# Altium schematic sheet Power Supply.SchDoc
size A
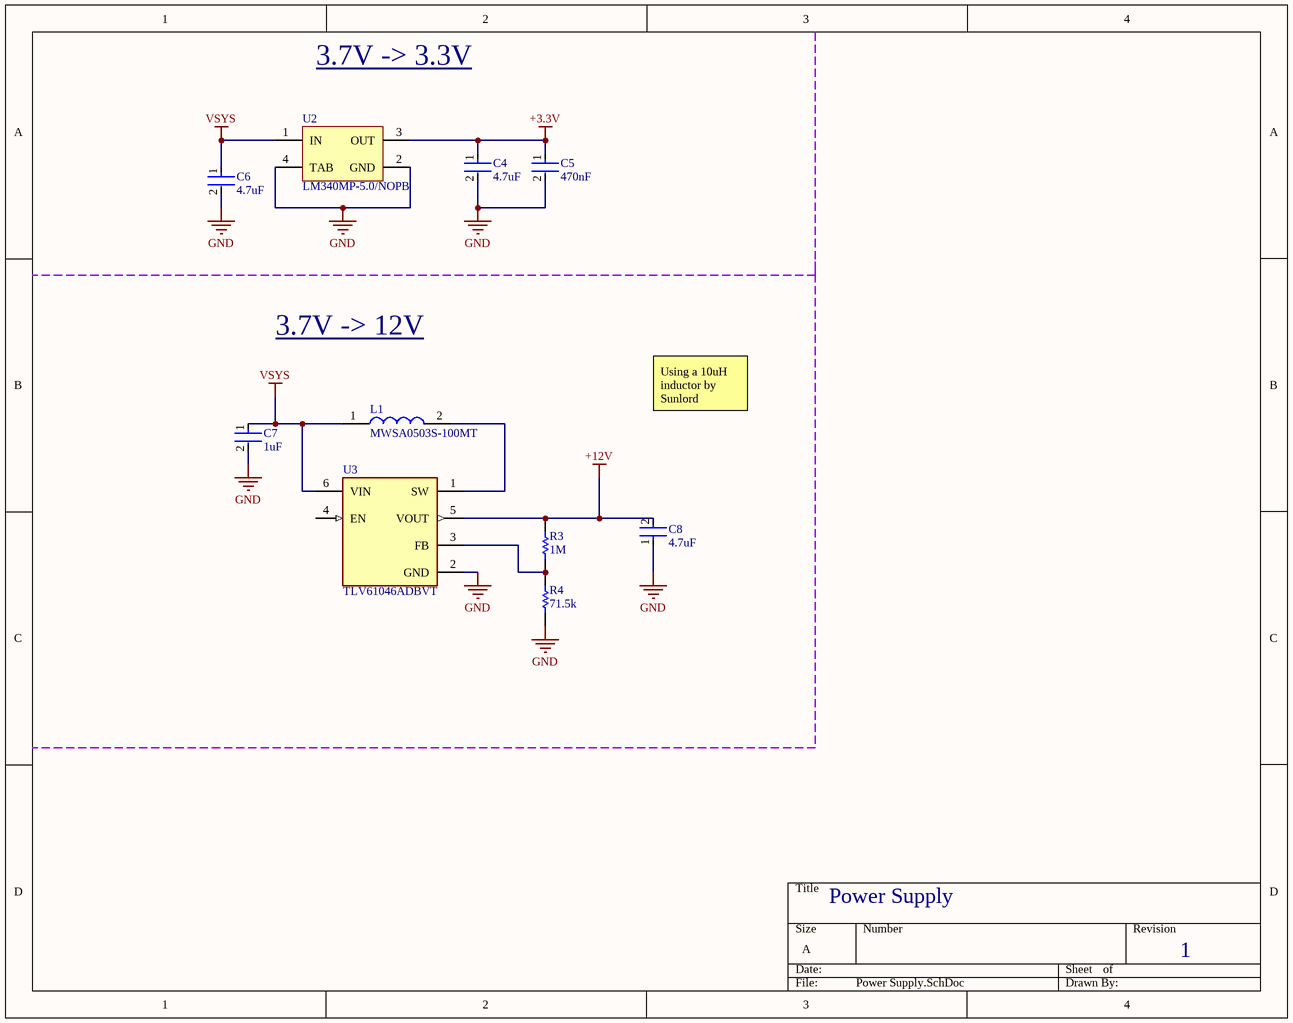
[diagram p0: Power Supply.SchDoc]

## Parts
C4  4.7uF  [FP-CC0805-0_85-MFG]
C5  470nF  [FP-CC0805-0_85-MFG]
C6  4.7uF  [FP-CC0805-0_85-MFG]
C7  1uF  [FP-CC0805-0_85-MFG]
C8  4.7uF  [FP-CC0805-0_85-MFG]
L1  MWSA0503S-100MT  [MWSA0503S4R7MT]
R3  value 1M  [RESC2013X70X40ML20T20]  (hidden comment: Resistor 1k +/-1% 0805 125 mW)
R4  value 71.5k  [RESC2013X70X40ML20T20]  (hidden comment: Resistor 1k +/-1% 0805 125 mW)
U2  LM340MP-5.0/NOPB  [DCY0004A_L]
U3  TLV61046ADBVT  [FP-DBV0006A-MFG]

## Nets
+3.3V: C4.1 C5.1 U2.3(OUT)
+12V: C8.2 R3.2 U3.5(VOUT)
GND: C4.2 C5.2 C6.2 C7.2 C8.1 R4.1 U2.2(GND) U2.4(TAB) U3.2(GND)
VSYS: C6.1 C7.1 L1.1 U2.1(IN) U3.6(VIN)
NetL1_2: L1.2 U3.1(SW)
NetR3_1: R3.1 R4.2 U3.3(FB)

Not connected (* = marked no-connect by the designer): U3 4(EN)

## Notes on the sheet
- 3.7V -> 3.3V
- 3.7V -> 12V
- Using a 10uH inductor by Sunlord
  MFR.Part #MWSA0503S-100MT
  LCSC Part # C408412
  PackageSMD-5.2x5.4x2.8
  CAD model and footpring, using this one: MWSA0503S-4R7MT
- Power Supply
- 1

## Library data of the parts
C4-C8 = CMP-03422-000499-1: CAP CER 0.1UF 50V X7R 0805; Manufacturer Part Number: CC0805KRX7R9BB104; Manufacturer: Yageo; Tolerance: 0.1; Capacitance: 100 nF; Value: 100 nF; Material: Ceramic; Device Class L1: Passive Components; ComponentLink2Description: Datasheet; Package: CC0805-0.85; Digikey Description: CAP CER 0.1UF 50V X7R 0805; Device Class L3: Ceramic Capacitors; Temperature: -30°C to +85°C; Temperature Characteristic: X7R; Voltage Rating: 50 V; Height: 0.95mm; RoHS: TRUE; Ipc Land Pattern Name: CAPC200125X85; Device Class L2: Capacitors; Category: Cap; Temperature Range Low: -30°C; Temperature Range High: +85°C; Mouser Description: Multilayer Ceramic Capacitors MLCC - SMD/SMT 100nF 50V X7R 10%; Footprint Url: http://www.yageo.com/exep/pages/download/literatures/UPY-C_GEN_24.pdf; Automotive: No; Octopart: https://octopart.com/cc0805krx7r9bb104-yageo-192993; Lead Free: Yes; ComponentLink2URL: http://www.yageo.com/documents/recent/UPY-GPHC_Y5V_6.3V-to-50V_8.pdf
L1 = MWSA0503S-4R7MT: Inductor / MWSA0503S-100MT / LCSC Part # C408412 / PackageSMD-5.2x5.4x2.8 / MWSA0503S-4R7MT / Manufacturer Sunlord / Actual part is MWSA0503S-100MT but using the footpring and 3D CAD from this one (MWSA0503S-4R7MT) bc they have the same footprint; Datasheet Link: https://datasheet.lcsc.com/szlcsc/1908262302_Sunlord-MWSA0503S-4R7MT_C408410.pdf; Height: 3mm; Manufacturer_Name: SUNLORD; Manufacturer_Part_Number: MWSA0503S-4R7MT
R3 R4 = CMP-009-00010-4: Chip Resistor, 1 KOhm, +/- 1%, 0.125 W, -55 to 155 degC, 0805 (2013 Metric); Power: 125mW; Voltage Rating: 150V; Min Operating Temperature: -55°C; RoHS Compliant: True; Max Operating Temperature: 155°C; Case/Package: 0805; Pins: 2; Tolerance: 1%; Mounting Technology: SM
U2 = CMP-0062-01784-3: Series 3-Terminal Positive Regulators, 4-pin SOT-223, Pb-Free / LCSC Part # C131990; Manufacturer: Texas Instruments; PowerWise: N; CompType: LDO IC; PackageTopMarking: XYTT*N00A; Code_IPC: SOT223-4; PackageReference: DCY0004A; ComponentLink1Description: Datasheet URL; PackageDescription: Molded SOT-223, 6.50 x 3.56 x 1.6mm Body, 4 Lead, 2.3mm Pitch; PinCount: 4; RoHS: Y; ComponentLink1URL: http://www.ti.com/general/docs/lit/getliterature.tsp?genericPartNumber=LM340-N&fileType=pdf; Code_JEDEC: TO-261-AA
U3 = CMP-04918-000055-1: IC REG BOOST ADJ SOT23-6 / WON'T BE POPULATED BY MANUFACTURER; Manufacturer: Texas Instruments; Output Current: 980mA; Standoff Height: 0mm; Output Type: AdjustableProgrammable; Switching Frequency: 1050kHz; Max Junction Temp: +125°C; Nominal Supply Current: 110uA; Number Of Outputs: 1; Output Voltage: 3.3-28V; Min Supply Voltage: 1.8V; Max Duty Cycle: 90%; Max Supply Voltage: 5.5V; Device Class L2: Power Management ICs; Switching Topology: Boost; Temperature Range Low: -40°C; Lead Free: Yes; ComponentLink2URL: http://www.ti.com/lit/ds/symlink/tlv61046a.pdf; Category: IC; Package: DBV0006A; Ipc Land Pattern Name: SOT95P280X145-6; Automotive: No; Temperature Range High: +125°C; Temperature: -40°C to +125°C; Octopart: https://octopart.com/tlv61046adbvt-texas+instruments-81856327; ComponentLink2Description: Datasheet; Manufacturer Part Number: TLV61046ADBVT; Device Class L3: Voltage Regulators - Switching; Device Class L1: Integrated Circuits (ICs); Digikey Description: IC REG BOOST ADJ SOT23-6; Height: 1.45mm; RoHS: TRUE